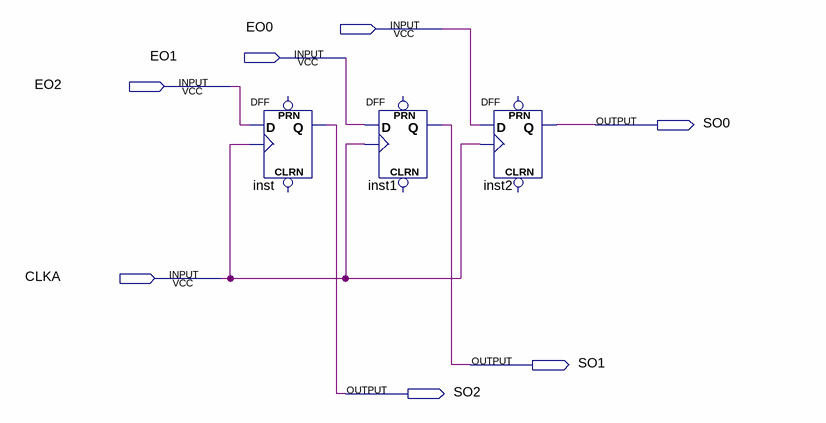
[diagram p0: schematic sheet]
// Quartus schematic RegOpe.bdf as structural Verilog: 3 symbols, 7 pins
module RegOpe (
  input  EO0,
  input  EO1,
  input  EO2,
  input  CLKA,
  output SO0,
  output SO1,
  output SO2
);

  DFF inst (.CLK(CLKA), .D(EO2), .Q(SO2));  // open: CLRN, PRN
  DFF inst1 (.CLK(CLKA), .D(EO1), .Q(SO1));  // open: CLRN, PRN
  DFF inst2 (.CLK(CLKA), .D(EO0), .Q(SO0));  // open: CLRN, PRN
endmodule
